# EasyEDA Pro project FanTempController.eprj

# Schematic Schematic1

## Sheets
1 Power: Board Name: Board1; Create Date: 2025-06-21; Page Name: Power; Project Name: FanTempController; Schematic Name: Schematic1; Update Date: 2025-07-06; Company: 嘉立创EDA; Page Size: A4; Version: V1.0
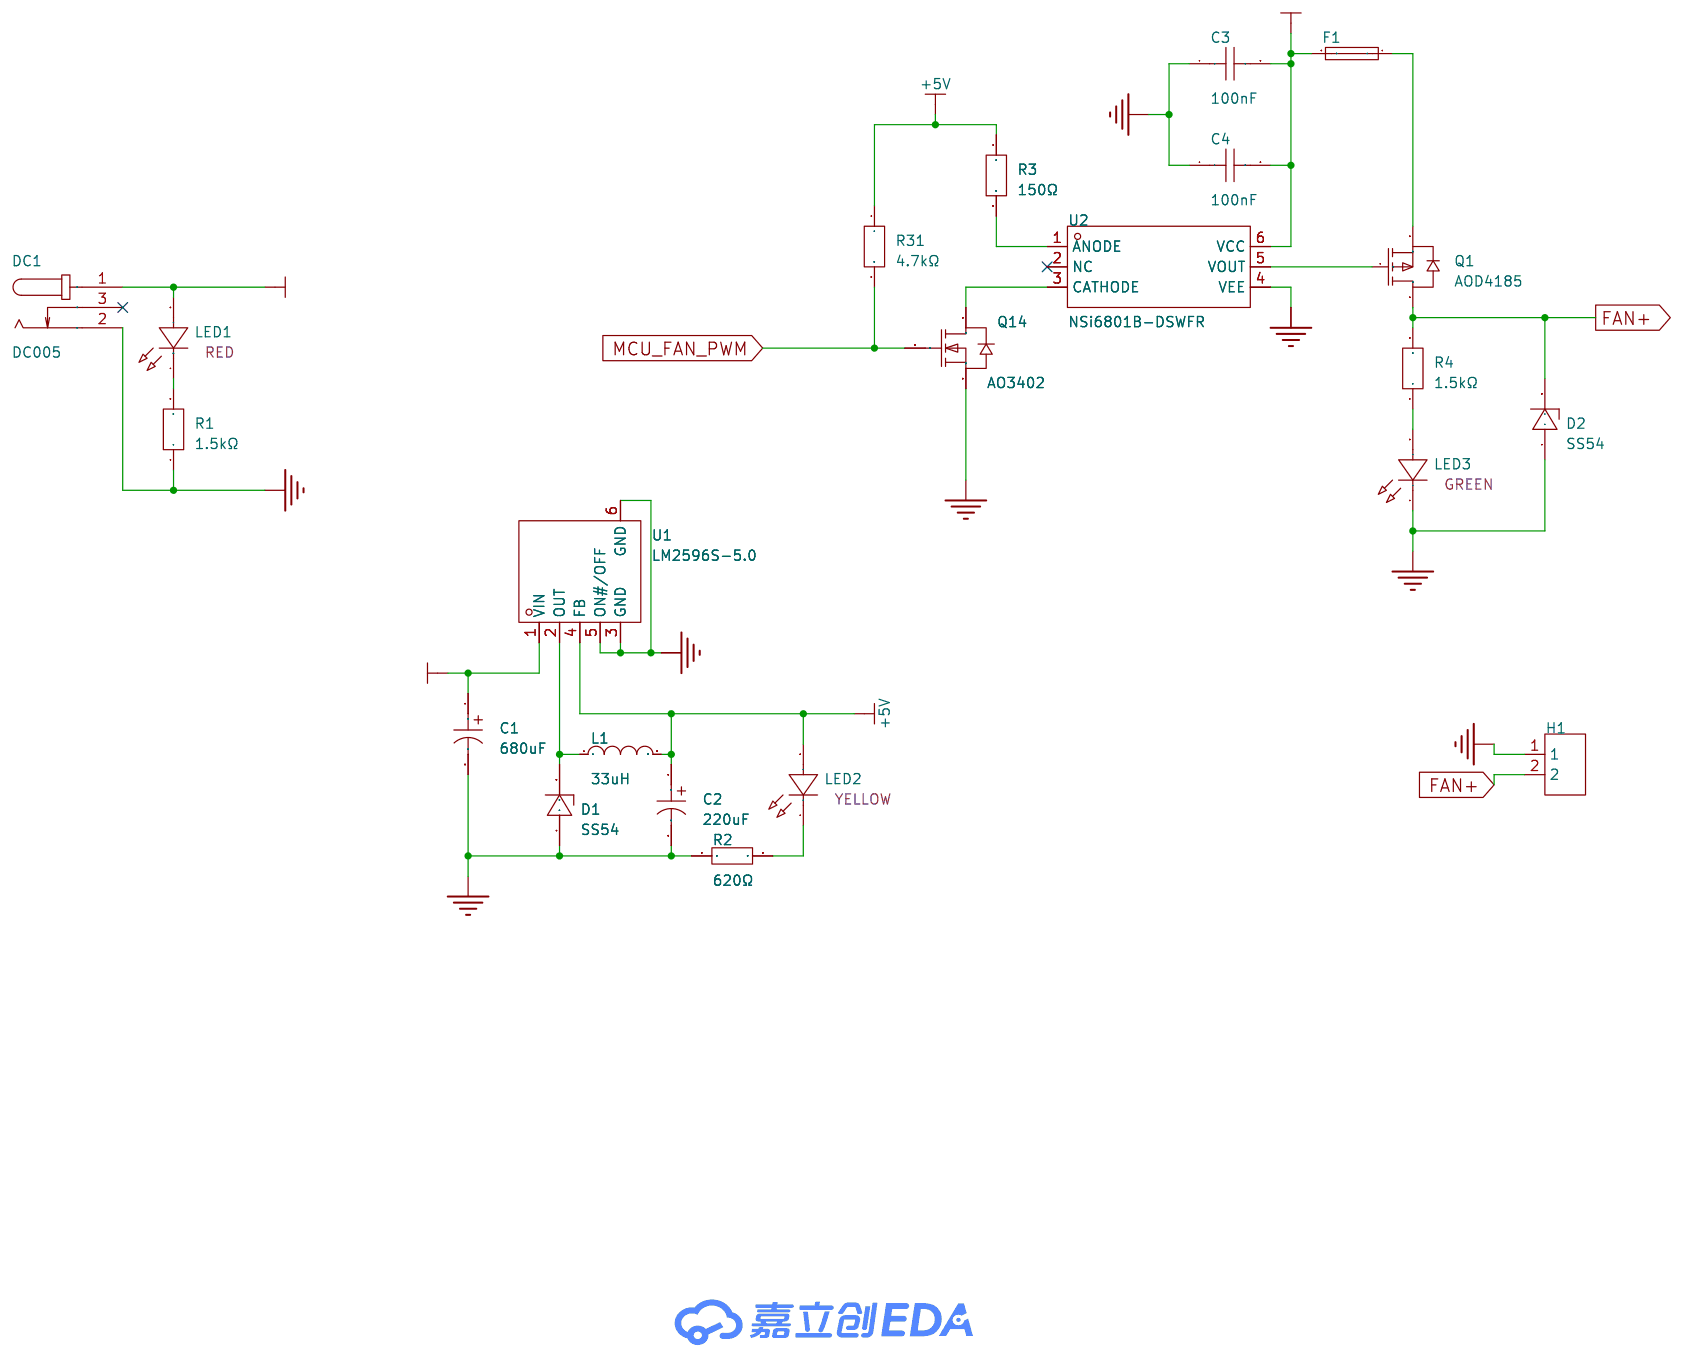
[diagram p0: Power]
2 MCU: Create Date: 2025-06-22; Page Name: MCU; Update Date: 2025-07-05
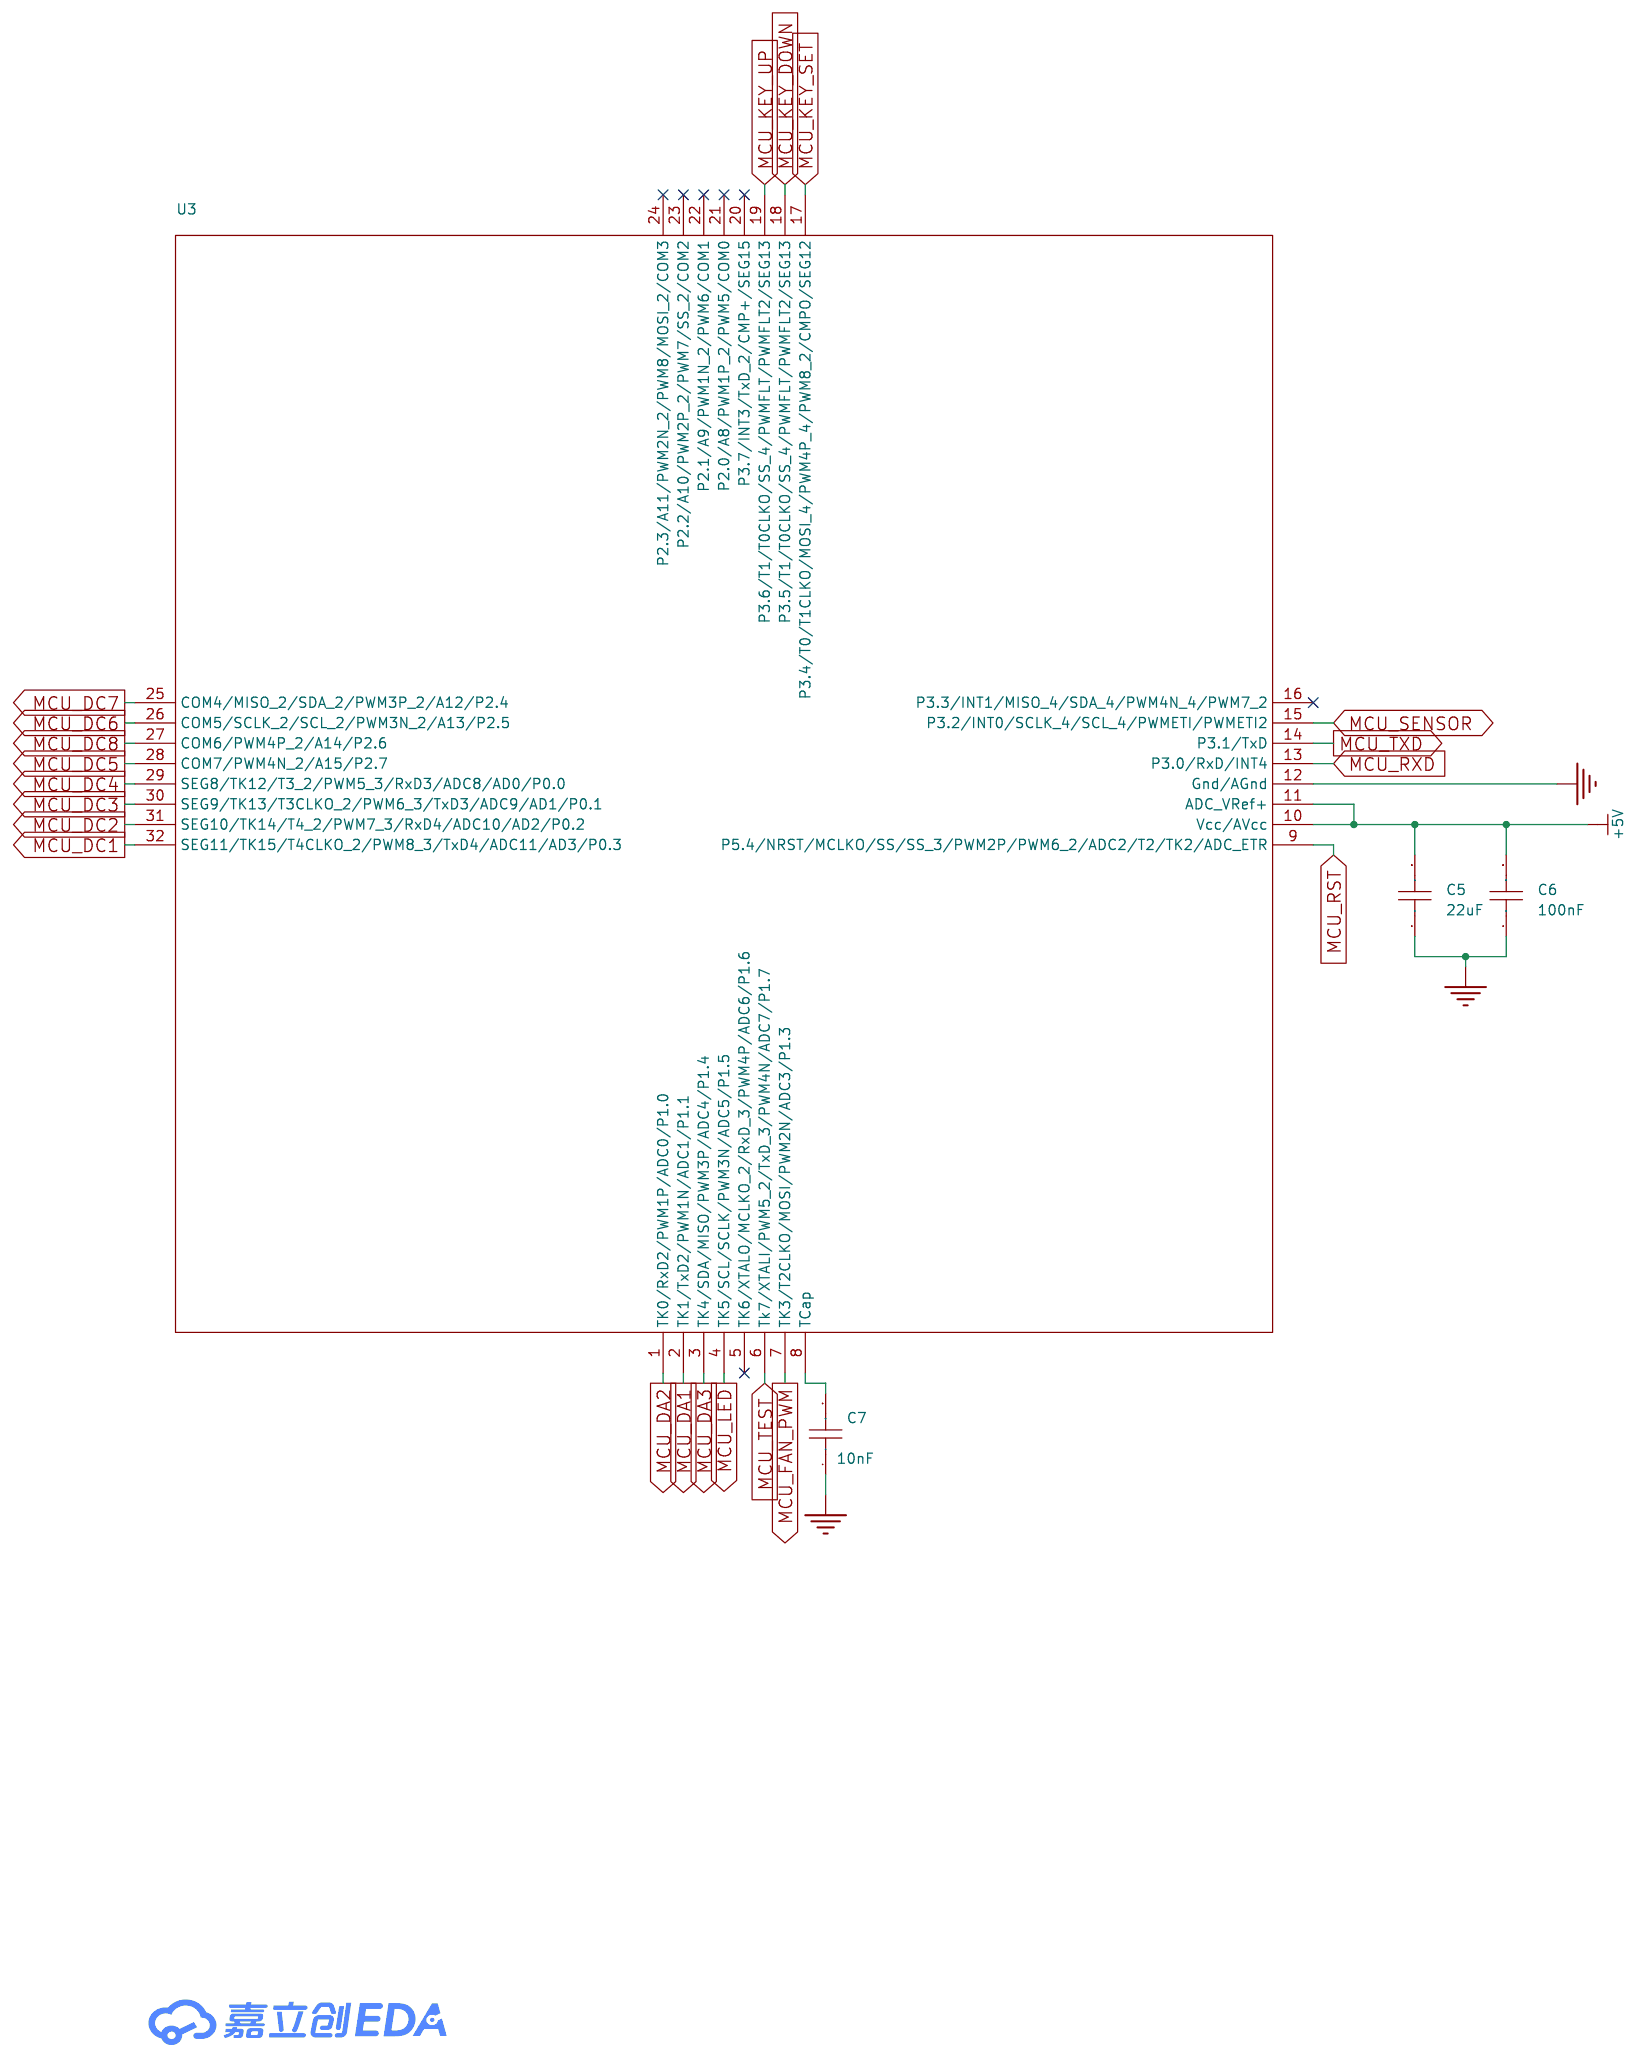
[diagram p1: MCU]
3 Others: Create Date: 2025-06-22; Page Name: Others; Update Date: 2025-06-26
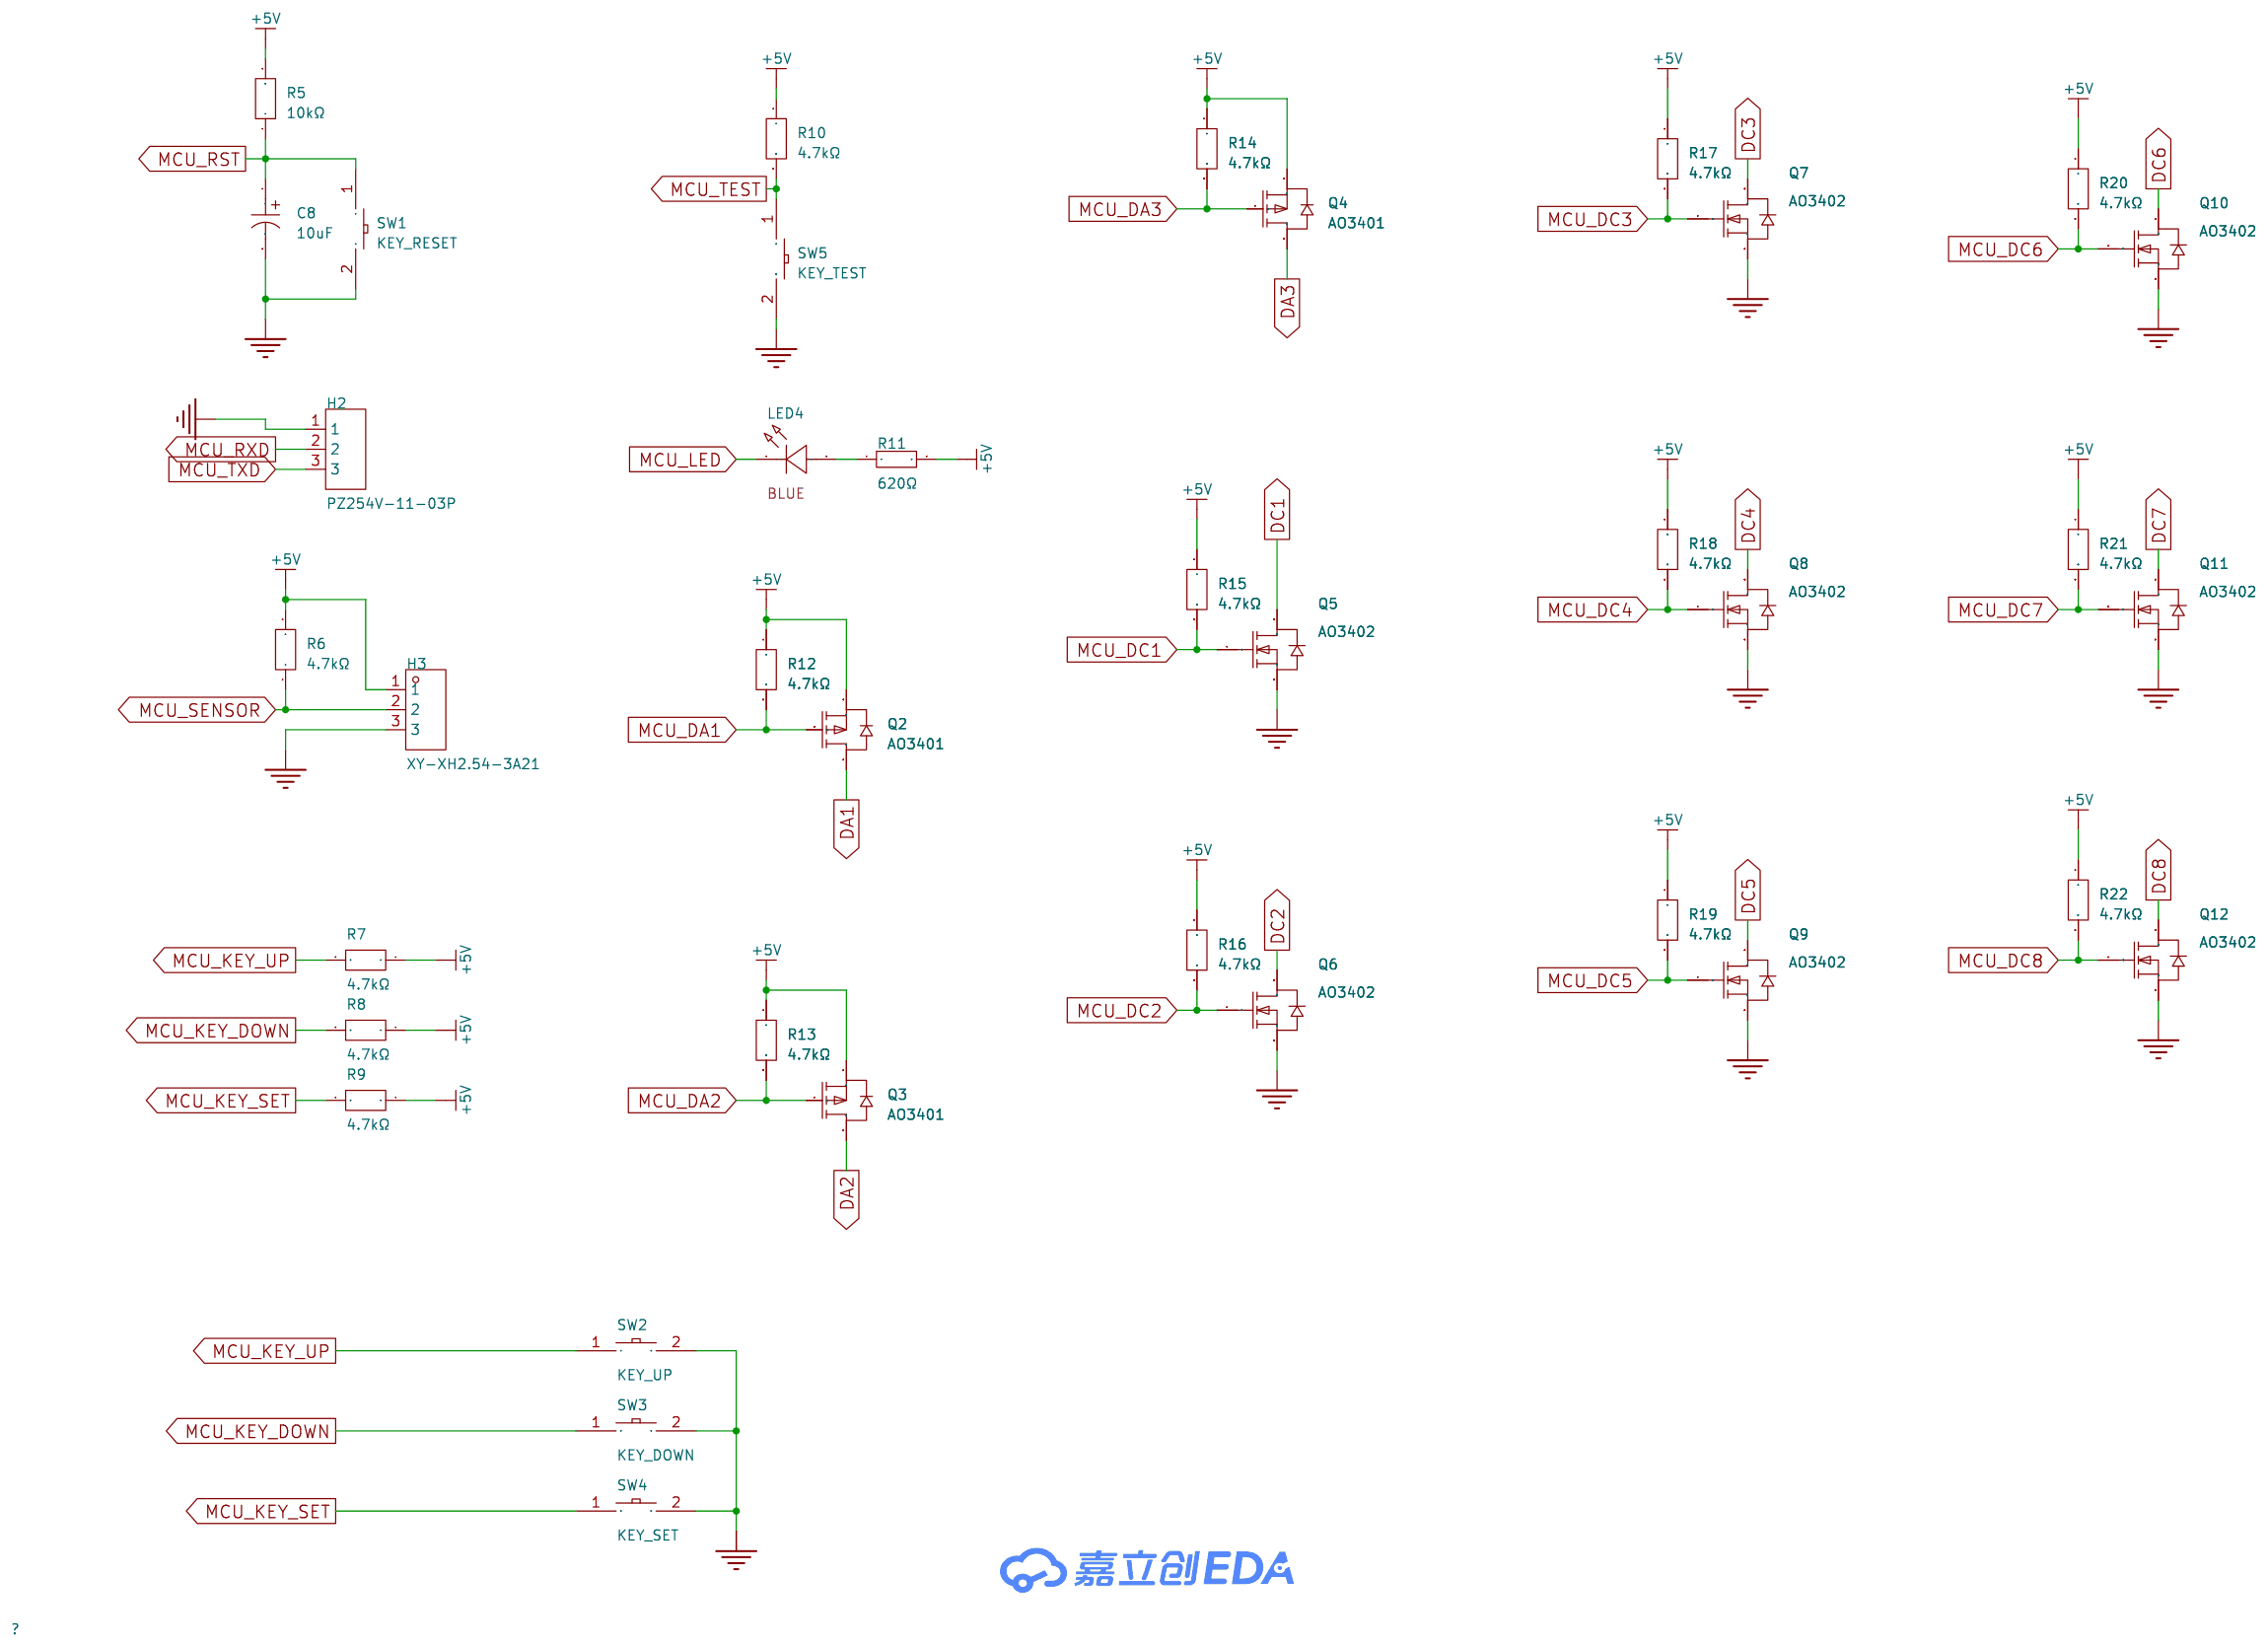
[diagram p2: Others]
4 Display: Create Date: 2025-06-22; Page Name: Display; Update Date: 2025-06-26
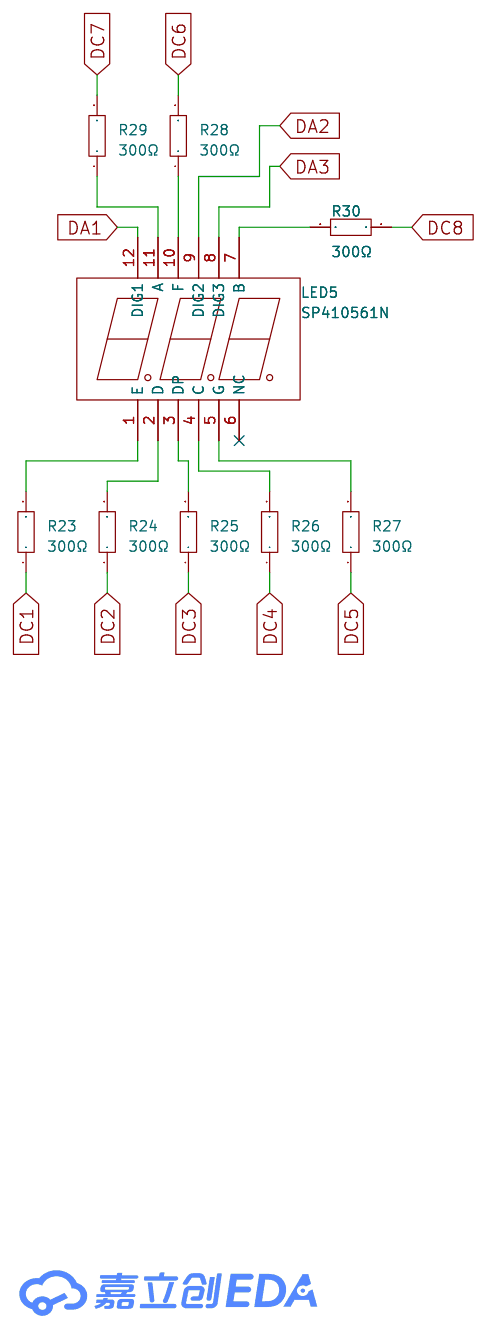
[diagram p3: Display]

## Parts
sheet Display
LED5  SP410561N  [LED-SEG-TH_12P-L37.6-W19.0-P2.54-S15.24-BL]
R23  300Ω  [R0805]
R24  300Ω  [R0805]
R25  300Ω  [R0805]
R26  300Ω  [R0805]
R27  300Ω  [R0805]
R28  300Ω  [R0805]
R29  300Ω  [R0805]
R30  300Ω  [R0805]
sheet MCU
C5  22uF  [C0805]
C6  100nF  [C0805]
C7  10nF  [C0805]
U3  -  [LQFP-32_L7.0-W7.0-P0.80-LS9.0-BL]
sheet Others
C8  10uF  [CAP-SMD_BD4.0-L4.3-W4.3-LS5.0-FD]
H2  PZ254V-11-03P  [HDR-TH_3P-P2.54-V-M]
H3  XY-XH2.54-3A21  [HDR-TH_3P-P2.50-H-F-W7.0-N]
LED4  LTL1KHKSD-071A  [LED-TH_BD3.8-P2.54-RD]
Q2  AO3401  [SOT-23-3_L2.9-W1.6-P1.90-LS2.8-BR]
Q3  AO3401  [SOT-23-3_L2.9-W1.6-P1.90-LS2.8-BR]
Q4  AO3401  [SOT-23-3_L2.9-W1.6-P1.90-LS2.8-BR]
Q5  AO3402  [SOT-23_L2.9-W1.3-P1.90-LS2.4-BR]
Q6  AO3402  [SOT-23_L2.9-W1.3-P1.90-LS2.4-BR]
Q7  AO3402  [SOT-23_L2.9-W1.3-P1.90-LS2.4-BR]
Q8  AO3402  [SOT-23_L2.9-W1.3-P1.90-LS2.4-BR]
Q9  AO3402  [SOT-23_L2.9-W1.3-P1.90-LS2.4-BR]
Q10  AO3402  [SOT-23_L2.9-W1.3-P1.90-LS2.4-BR]
Q11  AO3402  [SOT-23_L2.9-W1.3-P1.90-LS2.4-BR]
Q12  AO3402  [SOT-23_L2.9-W1.3-P1.90-LS2.4-BR]
R5  10kΩ  [R0805]
R6  4.7kΩ  [R0805]
R7  4.7kΩ  [R0805]
R8  4.7kΩ  [R0805]
R9  4.7kΩ  [R0805]
R10  4.7kΩ  [R0805]
R11  620Ω  [R0805]
R12  4.7kΩ  [R0805]
R13  4.7kΩ  [R0805]
R14  4.7kΩ  [R0805]
R15  4.7kΩ  [R0805]
R16  4.7kΩ  [R0805]
R17  4.7kΩ  [R0805]
R18  4.7kΩ  [R0805]
R19  4.7kΩ  [R0805]
R20  4.7kΩ  [R0805]
R21  4.7kΩ  [R0805]
R22  4.7kΩ  [R0805]
SW1  KEY_RESET  [SW-SMD_L6.0-W3.5-LS8.1_UK-B0306T-WB-250JZ]
SW2  KEY_UP  [SW-SMD_L6.0-W3.5-LS8.1_UK-B0306T-WB-250JZ]
SW3  KEY_DOWN  [SW-SMD_L6.0-W3.5-LS8.1_UK-B0306T-WB-250JZ]
SW4  KEY_SET  [SW-SMD_L6.0-W3.5-LS8.1_UK-B0306T-WB-250JZ]
SW5  KEY_TEST  [SW-SMD_L6.0-W3.5-LS8.1_UK-B0306T-WB-250JZ]
sheet Power
C1  680uF  [CAP-SMD_BD10.0-L10.3-W10.3-LS11.0-FD]
C2  220uF  [CAP-SMD_BD8.0-L8.3-W8.3-FD]
C3  100nF  [C0805]
C4  100nF  [C0805]
D1  SS54  [SMA_L4.3-W2.6-LS5.0-FD]
D2  SS54  [SMA_L4.3-W2.6-LS5.0-FD]
DC1  DC005  [DC-IN-TH_DC005]
F1  SMD1812-200-30  [F1812]
H1  B25410120-2PB0513-H25A60  [HDR-TH_2P-P2.54-V-M-3]
L1  33uH  [IND-SMD_L11.0-W10.2_CXP1050]
LED1  LTL17KRH5D-012A  [LED-TH_BD3.8-P2.54-RD-RED]
LED2  LTL1KHKSD-071A  [LED-TH_BD3.8-P2.54-RD]
LED3  LTL1KHKSD-071A  [LED-TH_BD3.8-P2.54-RD]
Q1  AOD4185  [TO-252-3_L6.6-W6.1-P4.57-LS9.9-BR-CW]
Q14  AO3402  [SOT-23_L2.9-W1.3-P1.90-LS2.4-BR]
R1  1.5kΩ  [R0805]
R2  620Ω  [R0805]
R3  150Ω  [R0805]
R4  1.5kΩ  [R0805]
R31  4.7kΩ  [R0805]
U1  LM2596S-5.0  [TO-263-5_L10.1-W8.7-P1.70-LS15.2-BR]
U2  NSi6801B-DSWFR  [SOIC-6_L7.5-W4.7-P1.27-LS11.50-TL]

## Library data of the parts
LED5 = SP410561N: LCSC Part Name: 3位0.56英寸红色数码管 共阳极; Supplier Part: C98924; Manufacturer: ARKLED(方舟); Supplier Footprint: 插件; JLCPCB Part Class: 扩展库; Datasheet: https://atta.szlcsc.com/upload/public/pdf/source/20180620/C98924_8B6F6D234E67B3F37673B777B8AFD976.pdf; Supplier: LCSC; Number of Characters: 3位; Luminous Color: 红色; LED Polarity: 共阳极; Digit/Alpha Size(inch): 0.56
R23-R30 = 0805W8F3000T5E: LCSC Part Name: 300Ω ±1% 125mW 厚膜电阻; Supplier Part: C17617; Manufacturer: UNI-ROYAL(厚声); Supplier Footprint: 0805; JLCPCB Part Class: 基础库; Datasheet: https://atta.szlcsc.com/upload/public/pdf/source/20200306/C422600_1E6D84923E4A46A82E41ADD87F860B5C.pdf; Supplier: LCSC; Type: 厚膜电阻; Tolerance: ±1%; Power(Watts): 125mW; Overload Voltage (Max): 150V; Temperature Coefficient: ±100ppm/℃; Operating Temperature Range: -55℃~+155℃
C5 = CL21Z226MQYVPNE: LCSC Part Name: 22uF ±20% 6.3V; Supplier Part: C6150103; Manufacturer: SAMSUNG(三星); Supplier Footprint: 0805; JLCPCB Part Class: 扩展库; Datasheet: https://atta.szlcsc.com/upload/public/pdf/source/20241202/1BDE01DAB2E9CA02F4EFA28F0C1F172B.pdf; Supplier: LCSC; Tolerance: ±20%; Voltage Rating: 6.3V; Temperature Coefficient: X7T
C3 C4 C6 = C0805X104K5RAC7210: LCSC Part Name: 100nF ±10% 50V; Supplier Part: C1864747; Manufacturer: KEMET(基美); Supplier Footprint: 0805; JLCPCB Part Class: Extended Part; Datasheet: https://atta.szlcsc.com/upload/public/pdf/source/20210401/3EFD8A2EC703B271DBCBA89912FC6ADE.pdf; Supplier: LCSC; Tolerance: ±10%; Voltage Rated: 50V; Temperature Coefficient: X7R
C7 = GCM21B5G1H103GA16L: LCSC Part Name: 10nF ±2% 50V; Supplier Part: C17592858; Manufacturer: muRata(村田); Supplier Footprint: 0805; JLCPCB Part Class: Extended Part; Datasheet: https://atta.szlcsc.com/upload/public/pdf/source/20240122/08E091E21912DE6536BB1E339F96B54B.pdf; Supplier: LCSC; Tolerance: ±2%; Voltage Rated: 50V; Temperature Coefficient: X8G
U3 = STC8H4K64TL-40I-LQFP32
C8 = RVT16V10M4X5: LCSC Part Name: 10uF ±20% 16V; Supplier Part: C47023101; Manufacturer: 捷而瑞; Supplier Footprint: SMD,D4xL5.4mm; JLCPCB Part Class: 扩展库; Datasheet: https://atta.szlcsc.com/upload/public/pdf/source/20250527/B74112AC258D4E2957E94942C36CEC95.pdf; Supplier: LCSC; Tolerance: ±20%; Voltage Rating: 16V; Ripple Current: 17mA@120Hz; Diameter: 4mm; Height - Seated (Max): 5.4mm; Operating Temperature: -55℃~+105℃
H2 = PZ254V-11-03P: LCSC Part Name: 1x3P 间距:2.54mm 方针 直插; Supplier Part: C2937625; Manufacturer: XFCN(兴飞); Supplier Footprint: 插件,P=2.54mm; JLCPCB Part Class: Extended Part; Datasheet: https://atta.szlcsc.com/upload/public/pdf/source/20200309/C492402_8335C3D49C4E4C618838D59BB1D024C1.pdf; Supplier: LCSC; Pin Structure: 1x3P; Pitch: 2.54mm; Circluar Pins/Square Pins: 方针; Mounting Type: 直插; Number of Rows: 单排; Number of Pins: 3P; Current Rating: 3A; Voltage Rating (Max): 250V; Length of Mating Pin: 6mm; Insulation Height: 2.5mm; Length of End Connection Pin: 3mm; Operating Temperature: -40℃~+105℃; Color: 黑色
H3 = XY-XH2.54-3A21: LCSC Part Name: 1x3P 间距:2.54mm 弯插; Supplier Part: C19271378; Manufacturer: XYECONN(辛译); Supplier Footprint: 弯插,P=2.54mm; JLCPCB Part Class: Extended Part; Datasheet: https://atta.szlcsc.com/upload/public/pdf/source/20231124/D66390E8C06C0EE50596E66A88591188.pdf; Supplier: LCSC; Pins Structure: 1x3P; Pitch: 2.54mm; Mounting Style: 弯插; Number of Pins: 3P; Number of Rows: 1; Number of PINs Per Row: 3; Row Spacing: 2.54mm; Current Rating (Max): 3A; Operating Temperature Range: -25℃~+85℃
LED4 = LTL1KHKSD-071A: LCSC Part Name: 插件LED; Supplier Part: C7435546; Manufacturer: LITEON(光宝); Supplier Footprint: D=3mm; JLCPCB Part Class: 扩展库; Supplier: LCSC; Emitted Color: BLUE
Q2-Q4 = AO3401_1: LCSC Part Name: AO3401 4.4A  P MOS大体积; Supplier Part: C20634975; Manufacturer: FOSAN(富捷/富信); Supplier Footprint: SOT-23-3L; JLCPCB Part Class: 扩展库; Datasheet: https://atta.szlcsc.com/upload/public/pdf/source/20240301/5324A8BF38A926A20CB45E863EAB25A7.pdf; Supplier: LCSC
Q5-Q12 Q14 = AO3402: LCSC Part Name: 1个N沟道 耐压:30V 电流:4A; Supplier Part: C14385; Manufacturer: AOS; Supplier Footprint: SOT-23; JLCPCB Part Class: 扩展库; Datasheet: https://atta.szlcsc.com/upload/public/pdf/source/20171023/C14385_15087455190191052858.pdf; Supplier: LCSC; Type: 1个N沟道; Drain Source Voltage (Vdss): 30V; Continuous Drain Current (Id): 4A; Drain Source On Resistance (RDS(on)@Vgs,Id): 43mΩ@10V,4A; Power Dissipation (Pd): 1.4W; Gate Threshold Voltage (Vgs(th)@Id): 1.5V@250uA; Total Gate Charge (Qg@Vgs): 12nC@10V; Input Capacitance (Ciss@Vds): 285pF; Reverse Transfer Capacitance (Crss@Vds): 25pF@15V; Operating Temperature: -55℃~+150℃
R5 = RCA0510KFLF: LCSC Part Name: 10kΩ ±1% 125mW; Supplier Part: C22356686; Manufacturer: HKR(香港电阻); Supplier Footprint: 0805; JLCPCB Part Class: 扩展库; Datasheet: https://atta.szlcsc.com/upload/public/pdf/source/20240312/EB29F8B3E9AD4CE07E65E9956C47F4F5.pdf; Supplier: LCSC; Tolerance: ±1%; Power(Watts): 125mW
R6-R10 R12-R22 R31 = SG73P2ATTD4701F: LCSC Part Name: 厚膜电阻 4.7kΩ ±1% 250mW; Supplier Part: C2577441; Manufacturer: KOA; Supplier Footprint: 0805; JLCPCB Part Class: 扩展库; Datasheet: https://atta.szlcsc.com/upload/public/pdf/source/20211128/256F1F916928CF6BBF01C1783BDAC507.pdf; Supplier: LCSC; Type: 厚膜电阻; Tolerance: ±1%; Power(Watts): 250mW; Temperature Coefficient: ±100ppm/℃; Operating Temperature: -55℃~+155℃
R2 R11 = 0805W8F6200T5E: LCSC Part Name: 620Ω ±1% 125mW 厚膜电阻; Supplier Part: C17782; Manufacturer: UNI-ROYAL(厚声); Supplier Footprint: 0805; JLCPCB Part Class: 扩展库; Datasheet: https://atta.szlcsc.com/upload/public/pdf/source/20200306/C422600_1E6D84923E4A46A82E41ADD87F860B5C.pdf; Supplier: LCSC; Type: 厚膜电阻; Tolerance: ±1%; Power(Watts): 125mW; Overload Voltage (Max): 150V; Temperature Coefficient: ±100ppm/℃; Operating Temperature Range: -55℃~+155℃
SW1-SW5 = UK-B0306T-WB-250JZ: LCSC Part Name: 轻触开关3.5*6*2.5贴片黑座白钮250GF 编带; Supplier Part: C7428411; Manufacturer: USAKRO(美韩); Supplier Footprint: SMD,3.5x6x2.5mm; JLCPCB Part Class: Extended Part; Datasheet: https://atta.szlcsc.com/upload/public/pdf/source/20230630/5D05E5B1B5E89E0622C76057B9B8311C.pdf; Supplier: LCSC; Operating Force: 2.5N; Switch Length: 6mm; Switch Width: 3.5mm; Switch Height: 2.5mm
C1 = GVE1E687M1010CN: LCSC Part Name: 680uF ±20% 25V; Supplier Part: C22383566; Manufacturer: ACMECON(鼎容); Supplier Footprint: SMD,D10xL10.5mm; JLCPCB Part Class: 扩展库; Datasheet: https://atta.szlcsc.com/upload/public/pdf/source/20240711/A40BBE00FFBCD7222582D0C7E53901B6.pdf; Supplier: LCSC; Tolerance: ±20%; Voltage Rating: 25V; Ripple Current: 670mA@100kHz
C2 = GVT1V227M0810CNVC: LCSC Part Name: 220uF ±20% 35V; Supplier Part: C2983323; Manufacturer: HRK(鸿瑞凯电子); Supplier Footprint: SMD,D8xL10.5mm; JLCPCB Part Class: 扩展库; Datasheet: https://atta.szlcsc.com/upload/public/pdf/source/20220321/BA17E910A44EA2B508CDD6AB8BA576BA.pdf; Supplier: LCSC; Tolerance: ±20%; Rated Voltage: 35V; Ripple Current: 175mA@120Hz; φD: 8mm; L: 10.5mm; Lifetime @ Temp: 2000hrs@105℃; Operating Temperature: -55℃~+105℃
D1 D2 = SS54_C7420369: LCSC Part Name: 电压:40V 电流:5A; Supplier Part: C7420369; Manufacturer: 宏迦橙; Supplier Footprint: SMA(DO-214AC); JLCPCB Part Class: 扩展库; Datasheet: https://atta.szlcsc.com/upload/public/pdf/source/20230828/254C3882F8647358AD9F60DD73611B5E.pdf; Supplier: LCSC; Diode Configuration: 独立式; Forward Voltage (Vf@If): 550mV@5.0A; Reverse Voltage (Vr): 40V; Rectified Current: 5A; Reverse Leakage Current (Ir): 50uA@40V
DC1 = DC005: LCSC Part Name: DC电源插座 内径:2mm 外径:6.3mm; Supplier Part: C431533; Manufacturer: SHOU HAN(首韩); Supplier Footprint: 插件; JLCPCB Part Class: 扩展库; Datasheet: https://atta.szlcsc.com/upload/public/pdf/source/20190925/C431533_4751811035784AC1D38EBC85F7905E99.pdf; Supplier: LCSC; Connector Type: DC电源插座; Mounting Style: 弯插; Inside Contact Diameter: 2mm; Outside Contact Diameter: 6.3mm; Current Rating (Max): 500mA; Voltage Rating (Max): 30V; Operating Temperature Range: -25℃~+70℃
F1 = SMD1812-200-30: Supplier Part: C46641168; Manufacturer: 宏嘉诚; Supplier Footprint: 1812; JLCPCB Part Class: 扩展库; Datasheet: https://atta.szlcsc.com/upload/public/pdf/source/20250414/001E61D6A0C78432CBCACDD44FA2AE48.pdf; Supplier: LCSC; Voltage - Max: 30V; Current - Max: 40A; Hold Current: 2A; Trip Current: 4A; Power Dissipation: 1W; Resistance - Initial (Ri) (Min): 20mΩ; Resistance - Post Trip (R1) (Max): 100mΩ; Time to Trip(Max): 2s
H1 = B25410120-2PB0513-H25A60: LCSC Part Name: 间距:2.54mm 1X2P 直插 方针; Supplier Part: C42385478; Manufacturer: HMTCONN(华明通); Supplier Footprint: 插件,P=2.54mm; Datasheet: https://atta.szlcsc.com/upload/public/pdf/source/20241114/BA9A59CA6DEC78ECD42560940D1296C3.pdf; Supplier: LCSC
L1 = CXP1050-6R8M-AG(6.8uh): LCSC Part Name: 6.8uH ±20% 13A; Supplier Part: C7461390; Manufacturer: DMBJ(振宝佳); Supplier Footprint: 1050; JLCPCB Part Class: 扩展库; Datasheet: https://atta.szlcsc.com/upload/public/pdf/source/20230706/7F3A5B39C5AD80A91C9FA782B54A296B.pdf; Supplier: LCSC; Tolerance: ±20%; Rated Current: 8.5A; Saturation Current (Isat): 13A; DC Resistance (DCR): 18.5mΩ; Type: 一体成型电感
LED1 = LTL17KRH5D-012A: LCSC Part Name: 插件LED; Supplier Part: C7435538; Manufacturer: LITEON(光宝); Supplier Footprint: D=3mm; JLCPCB Part Class: 扩展库; Supplier: LCSC; Emitted Color: RED
LED2 = LTL1KHKSD-071A: LCSC Part Name: 插件LED; Supplier Part: C7435546; Manufacturer: LITEON(光宝); Supplier Footprint: D=3mm; JLCPCB Part Class: 扩展库; Supplier: LCSC; Emitted Color: YELLOW
LED3 = LTL1KHKSD-071A: LCSC Part Name: 插件LED; Supplier Part: C7435546; Manufacturer: LITEON(光宝); Supplier Footprint: D=3mm; JLCPCB Part Class: 扩展库; Supplier: LCSC; Emitted Color: GREEN
Q1 = AOD4185_C400894: LCSC Part Name: 1个P沟道 耐压:40V 电流:40A; Supplier Part: C400894; Manufacturer: AOS; Supplier Footprint: TO-252(DPAK); JLCPCB Part Class: 扩展库; Datasheet: https://atta.szlcsc.com/upload/public/pdf/source/20190627/C400894_921958B6CB7B7C674397E60AAED89785.pdf; Supplier: LCSC; Type: 1个P沟道; Drain Source Voltage (Vdss): 40V; Continuous Drain Current (Id): 40A; Drain Source On Resistance (RDS(on)@Vgs,Id): 20mΩ@4.5V,15A; Power Dissipation (Pd): 62.5W; Gate Threshold Voltage (Vgs(th)@Id): 1.7V@250uA; Total Gate Charge (Qg@Vgs): 42nC@10V; Input Capacitance (Ciss@Vds): 2.55nF@20V; Reverse Transfer Capacitance (Crss@Vds): 190pF@20V; Operating Temperature: -55℃~+175℃
R1 R4 = FRC0805F1501TS: LCSC Part Name: 1.5kΩ ±1% 125mW 厚膜电阻; Supplier Part: C2907216; Manufacturer: FOJAN(富捷); Supplier Footprint: 0805; JLCPCB Part Class: 扩展库; Datasheet: https://atta.szlcsc.com/upload/public/pdf/source/20211221/925EC7D7225764EE0046F22065062C87.pdf; Supplier: LCSC; Type: 厚膜电阻; Tolerance: ±1%; Power(Watts): 125mW; Voltage-Supply(Max): 150V; Temperature Coefficient: ±100ppm/℃; Operating Temperature: -55℃~+155℃
R3 = FRC0805J151 TS: LCSC Part Name: 150Ω ±5% 125mW 厚膜电阻; Supplier Part: C2907300; Manufacturer: FOJAN(富捷); Supplier Footprint: 0805; JLCPCB Part Class: 扩展库; Datasheet: https://atta.szlcsc.com/upload/public/pdf/source/20211221/925EC7D7225764EE0046F22065062C87.pdf; Supplier: LCSC; Type: 厚膜电阻; Tolerance: ±5%; Power(Watts): 125mW; Overload Voltage (Max): 150V; Temperature Coefficient: ±100ppm/℃; Operating Temperature Range: -55℃~+155℃
U1 = LM2596S-5.0_C5276750: LCSC Part Name: 3A降压电压调节器; Supplier Part: C5276750; Manufacturer: TWGMC(台湾迪嘉); Supplier Footprint: TO-263-5; JLCPCB Part Class: 扩展库; Datasheet: https://atta.szlcsc.com/upload/public/pdf/source/20221121/BE66229392871E6008E3503EDFD620B9.pdf; Supplier: LCSC; Function: 降压型; Output Type: 固定; Output Voltage: 5V; Switching Frequency: 150kHz; Operating Temperature: -40℃~+125℃; Number of Outputs: 1; Topology: 降压式
U2 = NSi6801B-DSWFR_C3029750: Supplier Part: C3029750; Manufacturer: NOVOSENSE(纳芯微); Supplier Footprint: SOW-6; JLCPCB Part Class: 扩展库; Datasheet: https://atta.szlcsc.com/upload/public/pdf/source/20220531/230F2E7CF69C24FBD35BDDC065427607.pdf; Supplier: LCSC

## Nets
+5V: C2.1 C5.2 C6.2 H3.1 L1.2 LED2.2(A) Q2.2(S) Q3.2(S) Q4.2(S) R3.1 R5.2 R6.2 R7.1 R8.1 R9.1 R10.1 R11.2 R12.1 R13.1 R14.1 R15.1 R16.1 R17.1 R18.1 R19.1 R20.1 R21.1 R22.1 R31.1 U1.4(FB) U3.10(Vcc/AVcc) U3.11(ADC_VRef+)
GND: C1.2 C2.2 C3.1 C4.1 C5.1 C6.1 C7.1 C8.2 D1.1(A) D2.1(A) DC1.2 H1.1 H2.1 H3.3 LED3.1(K) Q5.2(S) Q6.2(S) Q7.2(S) Q8.2(S) Q9.2(S) Q10.2(S) Q11.2(S) Q12.2(S) Q14.2(S) R1.1 R2.1 SW1.2 SW2.2 SW3.2 SW4.2 SW5.2 U1.3(GND) U1.5(ON#/OFF) U1.6(GND) U2.4(VEE) U3.12(Gnd/AGnd)
DA1: LED5.12(DIG1) Q2.3(D)
DA2: LED5.9(DIG2) Q3.3(D)
DA3: LED5.8(DIG3) Q4.3(D)
DC1: Q5.3(D) R23.1
DC2: Q6.3(D) R24.1
DC3: Q7.3(D) R25.1
DC4: Q8.3(D) R26.1
DC5: Q9.3(D) R27.1
DC6: Q10.3(D) R28.2
DC7: Q11.3(D) R29.2
DC8: Q12.3(D) R30.1
FAN+: D2.2(K) H1.2 Q1.2(D) R4.2
MCU_DA1: Q2.1(G) R12.2 U3.2(TK1/TxD2/PWM1N/ADC1/P1.1)
MCU_DA2: Q3.1(G) R13.2 U3.1(TK0/RxD2/PWM1P/ADC0/P1.0)
MCU_DA3: Q4.1(G) R14.2 U3.3(TK4/SDA/MISO/PWM3P/ADC4/P1.4)
MCU_DC1: Q5.1(G) R15.2 U3.32(SEG11/TK15/T4CLKO_2/PWM8_3/TxD4/ADC11/AD3/P0.3)
MCU_DC2: Q6.1(G) R16.2 U3.31(SEG10/TK14/T4_2/PWM7_3/RxD4/ADC10/AD2/P0.2)
MCU_DC3: Q7.1(G) R17.2 U3.30(SEG9/TK13/T3CLKO_2/PWM6_3/TxD3/ADC9/AD1/P0.1)
MCU_DC4: Q8.1(G) R18.2 U3.29(SEG8/TK12/T3_2/PWM5_3/RxD3/ADC8/AD0/P0.0)
MCU_DC5: Q9.1(G) R19.2 U3.28(COM7/PWM4N_2/A15/P2.7)
MCU_DC6: Q10.1(G) R20.2 U3.26(COM5/SCLK_2/SCL_2/PWM3N_2/A13/P2.5)
MCU_DC7: Q11.1(G) R21.2 U3.25(COM4/MISO_2/SDA_2/PWM3P_2/A12/P2.4)
MCU_DC8: Q12.1(G) R22.2 U3.27(COM6/PWM4P_2/A14/P2.6)
MCU_FAN_PWM: Q14.1(G) R31.2 U3.7(TK3/T2CLKO/MOSI/PWM2N/ADC3/P1.3)
MCU_KEY_DOWN: R8.2 SW3.1 U3.18(P3.5/T1/T0CLKO/SS_4/PWMFLT/PWMFLT2/SEG13)
MCU_KEY_SET: R9.2 SW4.1 U3.17(P3.4/T0/T1CLKO/MOSI_4/PWM4P_4/PWM8_2/CMPO/SEG12)
MCU_KEY_UP: R7.2 SW2.1 U3.19(P3.6/T1/T0CLKO/SS_4/PWMFLT/PWMFLT2/SEG13)
MCU_LED: LED4.1(K) U3.4(TK5/SCL/SCLK/PWM3N/ADC5/P1.5)
MCU_RST: C8.1 R5.1 SW1.1 U3.9(P5.4/NRST/MCLKO/SS/SS_3/PWM2P/PWM6_2/ADC2/T2/TK2/ADC_ETR)
MCU_RXD: H2.2 U3.13(P3.0/RxD/INT4)
MCU_SENSOR: H3.2 R6.1 U3.15(P3.2/INT0/SCLK_4/SCL_4/PWMETI/PWMETI2)
MCU_TEST: R10.2 SW5.1 U3.6(Tk7/XTALI/PWM5_2/TxD_3/PWM4N/ADC7/P1.7)
MCU_TXD: H2.3 U3.14(P3.1/TxD)
VSUPPLY: C1.1 C3.2 C4.2 DC1.1 F1.2 LED1.2(A) U1.1(VIN) U2.6(VCC)
$1N933: D1.2(K) L1.1 U1.2(OUT)
$1N1155: LED1.1(C) R1.2
$1N1974: Q1.1(G) U2.5(VOUT)
$1N1988: F1.1 Q1.3(S)
$1N2065: LED2.1(K) R2.2
$1N2770: LED3.2(A) R4.1
$1N5073: Q14.3(D) U2.3(CATHODE)
$1N5078: R3.2 U2.1(ANODE)
$2N627: C7.2 U3.8(TCap)
$3N2148: LED4.2(A) R11.1
$4N526: LED5.1(E) R23.2
$4N532: LED5.2(D) R24.2
$4N539: LED5.3(DP) R25.2
$4N546: LED5.4(C) R26.2
$4N553: LED5.5(G) R27.2
$4N573: LED5.7(B) R30.2
$4N1142: LED5.10(F) R28.1
$4N1146: LED5.11(A) R29.1

Not connected (* = marked no-connect by the designer): DC1 3*; LED5 6(NC)*; U2 2(NC)*; U3 5(TK6/XTALO/MCLKO_2/RxD_3/PWM4P/ADC6/P1.6)* 16(P3.3/INT1/MISO_4/SDA_4/PWM4N_4/PWM7_2)* 20(P3.7/INT3/TxD_2/CMP+/SEG15)* 21(P2.0/A8/PWM1P_2/PWM5/COM0)* 22(P2.1/A9/PWM1N_2/PWM6/COM1)* 23(P2.2/A10/PWM2P_2/PWM7/SS_2/COM2)* 24(P2.3/A11/PWM2N_2/PWM8/MOSI_2/COM3)*

# Board PCB1
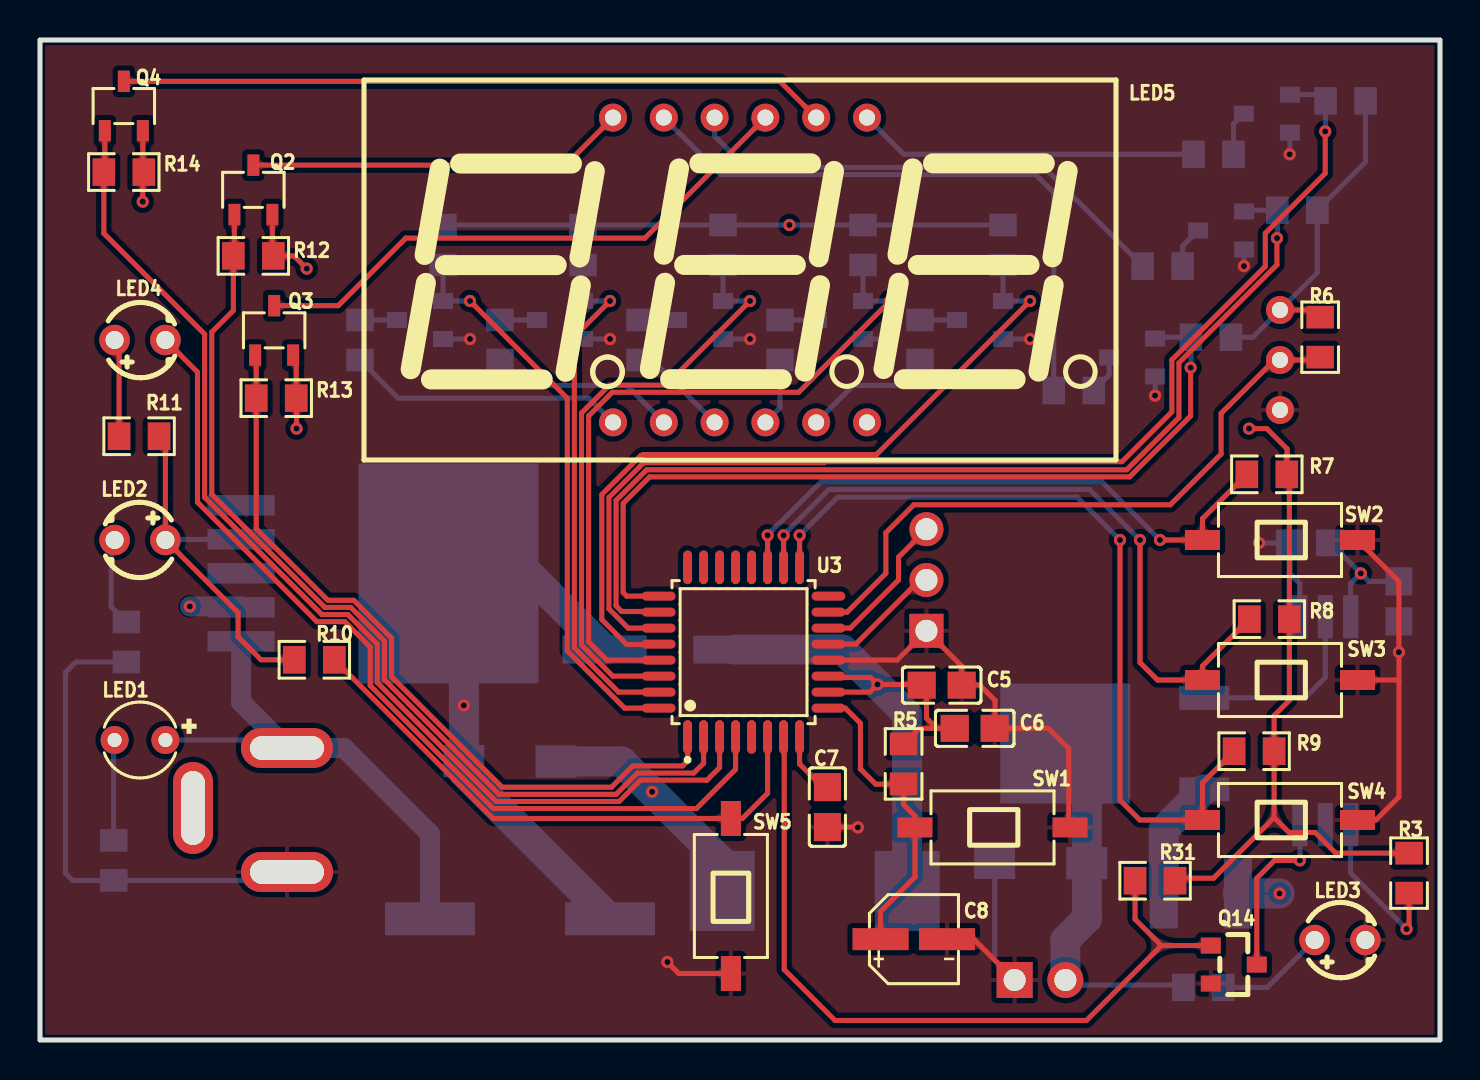
[diagram p4: board, top side]
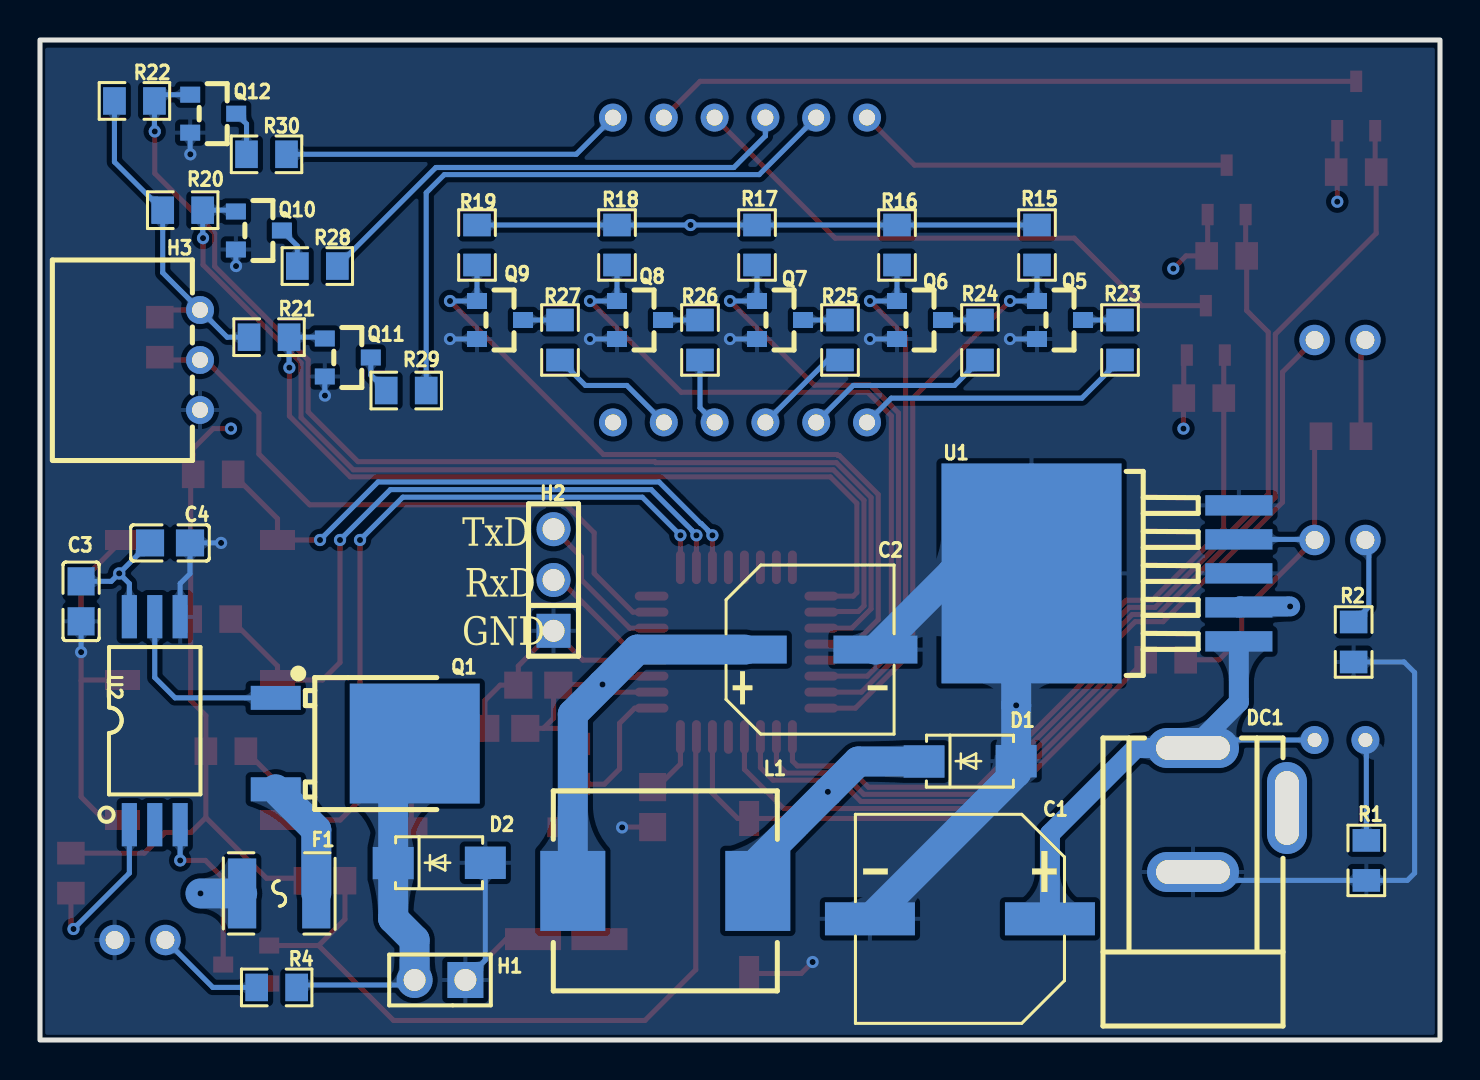
[diagram p5: board, bottom side, seen from below]

Outline 70 x 50 mm; copper layers: Top Layer, 地层, 供电层, Bottom Layer. Coordinates in mm from the lower left corner of the outline.
Outline path: rectangle 0,50 70,0
Stack: Top Layer 0.035mm 外层铜厚1oz / Dielectric1 0.2104mm 7628 RC49% 8.6mil / 地层 0.0152mm 内层铜厚 / Dielectric2 1.065mm 1.1mm H/HOZ Copper / 供电层 0.0152mm 内层铜厚 / Dielectric3 0.2104mm 7628 RC49% 8.6mil / Bottom Layer 0.035mm 外层铜厚1oz

## Design rules (mm)
template: JLCPCB Capability(Two Layers Board)
spacing copperThickness1oz (default): track to track 0.102, other pairs 0.152 to 0.3
spacing copperThickness2oz: track to track 0.203, other pairs 0.152 to 0.3
track width copperThickness1oz (default): min 0.127, default 0.254, max 2.54
track width copperThickness2oz: min 0.203, default 0.254, max 2.54
differential pair differentialPair (default): width min 0.127, default 0.254, max 2.54; gap min 0.152, default 0.152
via viaSize (default): diameter min 0.5, default 0.61, max 10; hole min 0.3, default 0.305, max 6.3

## Placement (name value [footprint] x y rotation side)
C1  680uF  [CAP-SMD_BD10.0-L10.3-W10.3-LS11.0-FD]  24 6.06 0 bottom
C2  220uF  [CAP-SMD_BD8.0-L8.3-W8.3-FD]  31.5 19.52 180 bottom
C3  100nF  [C0805]  67.94 21.93 90 bottom
C4  100nF  [C0805]  63.5 24.85 0 bottom
C5  22uF  [C0805]  45.09 17.74 180 top
C6  100nF  [C0805]  46.74 15.58 180 top
C7  10nF  [C0805]  39.37 11.65 90 top
C8  10uF  [CAP-SMD_BD4.0-L4.3-W4.3-LS5.0-FD]  43.69 5.04 0 top
D1  SS54  [SMA_L4.3-W2.6-LS5.0-FD]  23.5 13.93 0 bottom
D2  SS54  [SMA_L4.3-W2.6-LS5.0-FD]  50.04 8.85 0 bottom
DC1  DC005  [DC-IN-TH_DC005]  10 11.5 90 bottom
F1  SMD1812-200-30  [F1812]  58.04 7.33 0 bottom
H1  B25410120-2PB0513-H25A60  [HDR-TH_2P-P2.54-V-M-3]  50 3 0 bottom
H2  PZ254V-11-03P  [HDR-TH_3P-P2.54-V-M]  44.32 23 90 bottom
H3  XY-XH2.54-3A21  [HDR-TH_3P-P2.50-H-F-W7.0-N]  62 34 270 bottom
L1  33uH  [IND-SMD_L11.0-W10.2_CXP1050]  38.74 7.45 0 bottom
LED1  LTL17KRH5D-012A  [LED-TH_BD3.8-P2.54-RD-RED]  5 15 0 top
LED2  LTL1KHKSD-071A  [LED-TH_BD3.8-P2.54-RD]  5 25 0 top
LED3  LTL1KHKSD-071A  [LED-TH_BD3.8-P2.54-RD]  65 5 180 top
LED4  LTL1KHKSD-071A  [LED-TH_BD3.8-P2.54-RD]  5 35 180 top
LED5  SP410561N  [LED-SEG-TH_12P-L37.6-W19.0-P2.54-S15.24-BL]  35 38.5 0 top
Q1  AOD4185  [TO-252-3_L6.6-W6.1-P4.57-LS9.9-BR-CW]  54.74 14.82 0 bottom
Q2  AO3401  [SOT-23-3_L2.9-W1.6-P1.90-LS2.8-BR]  10.67 42.51 270 top
Q3  AO3401  [SOT-23-3_L2.9-W1.6-P1.90-LS2.8-BR]  11.71 35.48 270 top
Q4  AO3401  [SOT-23-3_L2.9-W1.6-P1.90-LS2.8-BR]  4.19 46.7 270 top
Q5  AO3402  [SOT-23_L2.9-W1.3-P1.90-LS2.4-BR]  19 36 0 bottom
Q6  AO3402  [SOT-23_L2.9-W1.3-P1.90-LS2.4-BR]  26 36 0 bottom
Q7  AO3402  [SOT-23_L2.9-W1.3-P1.90-LS2.4-BR]  33 36 0 bottom
Q8  AO3402  [SOT-23_L2.9-W1.3-P1.90-LS2.4-BR]  40 36 0 bottom
Q9  AO3402  [SOT-23_L2.9-W1.3-P1.90-LS2.4-BR]  47 36 0 bottom
Q10  AO3402  [SOT-23_L2.9-W1.3-P1.90-LS2.4-BR]  59.06 40.47 0 bottom
Q11  AO3402  [SOT-23_L2.9-W1.3-P1.90-LS2.4-BR]  54.61 34.12 0 bottom
Q12  AO3402  [SOT-23_L2.9-W1.3-P1.90-LS2.4-BR]  61.34 46.32 0 bottom
Q14  AO3402  [SOT-23_L2.9-W1.3-P1.90-LS2.4-BR]  59.69 3.77 180 top
R1  1.5kΩ  [R0805]  3.68 8.98 90 bottom
R2  620Ω  [R0805]  4.32 19.9 90 bottom
R3  150Ω  [R0805]  68.45 8.34 270 top
R4  1.5kΩ  [R0805]  58.17 2.63 180 bottom
R5  10kΩ  [R0805]  43.18 13.81 90 top
R6  4.7kΩ  [R0805]  64.01 35.14 90 top
R7  4.7kΩ  [R0805]  61.34 28.28 180 top
R8  4.7kΩ  [R0805]  61.47 21.04 180 top
R9  4.7kΩ  [R0805]  60.71 14.44 180 top
R10  4.7kΩ  [R0805]  13.72 19.01 0 top
R11  620Ω  [R0805]  4.95 30.19 0 top
R12  4.7kΩ  [R0805]  10.67 39.2 180 top
R13  4.7kΩ  [R0805]  11.81 32.09 180 top
R14  4.7kΩ  [R0805]  4.19 43.4 180 top
R15  4.7kΩ  [R0805]  20.15 39.75 270 bottom
R16  4.7kΩ  [R0805]  27.15 39.75 270 bottom
R17  4.7kΩ  [R0805]  34.15 39.75 270 bottom
R18  4.7kΩ  [R0805]  41.15 39.75 270 bottom
R19  4.7kΩ  [R0805]  48.15 39.75 270 bottom
R20  4.7kΩ  [R0805]  62.87 41.49 180 bottom
R21  4.7kΩ  [R0805]  58.55 35.14 180 bottom
R22  4.7kΩ  [R0805]  65.28 46.95 180 bottom
R23  300Ω  [R0805]  16 35 270 bottom
R24  300Ω  [R0805]  23 35 270 bottom
R25  300Ω  [R0805]  30 35 270 bottom
R26  300Ω  [R0805]  37 35 270 bottom
R27  300Ω  [R0805]  44 35 270 bottom
R28  300Ω  [R0805]  56.13 38.7 0 bottom
R29  300Ω  [R0805]  51.69 32.47 0 bottom
R30  300Ω  [R0805]  58.67 44.28 180 bottom
R31  4.7kΩ  [R0805]  55.75 7.96 180 top
SW1  KEY_RESET  [SW-SMD_L6.0-W3.5-LS8.1_UK-B0306T-WB-250JZ]  47.62 10.63 0 top
SW2  KEY_UP  [SW-SMD_L6.0-W3.5-LS8.1_UK-B0306T-WB-250JZ]  62 25 0 top
SW3  KEY_DOWN  [SW-SMD_L6.0-W3.5-LS8.1_UK-B0306T-WB-250JZ]  62 18 0 top
SW4  KEY_SET  [SW-SMD_L6.0-W3.5-LS8.1_UK-B0306T-WB-250JZ]  62 11 0 top
SW5  KEY_TEST  [SW-SMD_L6.0-W3.5-LS8.1_UK-B0306T-WB-250JZ]  34.54 7.2 270 top
U1  LM2596S-5.0  [TO-263-5_L10.1-W8.7-P1.70-LS15.2-BR]  15.24 23.33 180 bottom
U2  NSi6801B-DSWFR  [SOIC-6_L7.5-W4.7-P1.27-LS11.50-TL]  64.26 15.96 90 bottom
U3  -  [LQFP-32_L7.0-W7.0-P0.80-LS9.0-BL]  35.18 19.39 0 top

## Footprints (pads in the part's own frame, mm; a bottom-side part is the same pattern mirrored in y, then rotated)
C0805
  rect 1.41x1.35 smd: 1(-1,0) 2(1,0)
CAP-SMD_BD4.0-L4.3-W4.3-LS5.0-FD
  rect 2.8x1.1 smd: 1(-1.661,0) 2(1.661,0)
CAP-SMD_BD8.0-L8.3-W8.3-FD
  rect 4.2x1.4 smd: 1(-3.267,0) 2(3.267,0)
CAP-SMD_BD10.0-L10.3-W10.3-LS11.0-FD
  rect 4.5x1.65 smd: 1(-4.5,0) 2(4.5,0)
DC-IN-TH_DC005
  oval 2x4.6 hole 1.2x3.7: 1(3.1,2.35) 2(-3.1,2.35)
  oval 4.6x2 hole 3.7x1.2: 3(0.1,-2.35)
F1812
  rect 1.407x3.499 smd: 1(-1.853,0) 2(1.853,0)
HDR-TH_2P-P2.54-V-M-3
  rect 1.8x1.8 hole 1.1: 1(-1.27,0)
  round 1.8 hole 1.1: 2(1.27,0)
HDR-TH_3P-P2.50-H-F-W7.0-N
  round 1.4 hole 0.8: 1(-2.5,0) 2(0,0) 3(2.5,0)
HDR-TH_3P-P2.54-V-M
  rect 1.7x1.7 hole 1.1: 1(-2.54,0)
  round 1.7 hole 1.1: 2(0,0) 3(2.54,0)
IND-SMD_L11.0-W10.2_CXP1050
  rect 3.25x4 smd: 1(-4.625,0) 2(4.625,0)
LED-SEG-TH_12P-L37.6-W19.0-P2.54-S15.24-BL
  round 1.4 hole 0.8: 1(-6.35,-7.62) 2(-3.81,-7.62) 3(-1.27,-7.62) 4(1.27,-7.62) 5(3.81,-7.62) 6(6.35,-7.62) 7(6.35,7.62) 8(3.81,7.62) 9(1.27,7.62) 10(-1.27,7.62) 11(-3.81,7.62) 12(-6.35,7.62)
LED-TH_BD3.8-P2.54-RD
  round 1.524 hole 0.9: 1(-1.27,0) 2(1.27,0)
LED-TH_BD3.8-P2.54-RD-RED
  round 1.4 hole 0.7: 1(-1.27,0) 2(1.27,0)
LQFP-32_L7.0-W7.0-P0.80-LS9.0-BL
  oval 0.448x1.684 smd: 1(-2.8,-4.242) 2(-2,-4.242) 3(-1.2,-4.242) 4(-0.4,-4.242) 5(0.4,-4.242) 6(1.2,-4.242) 7(2,-4.242) 8(2.8,-4.242) 17(2.8,4.242) 18(2,4.242) 19(1.2,4.242) 20(0.4,4.242) 21(-0.4,4.242) 22(-1.2,4.242) 23(-2,4.242) 24(-2.8,4.242)
  oval 1.684x0.448 smd: 9(4.242,-2.8) 10(4.242,-2) 11(4.242,-1.2) 12(4.242,-0.4) 13(4.242,0.4) 14(4.242,1.2) 15(4.242,2) 16(4.242,2.8) 25(-4.242,2.8) 26(-4.242,2) 27(-4.242,1.2) 28(-4.242,0.4) 29(-4.242,-0.4) 30(-4.242,-1.2) 31(-4.242,-2) 32(-4.242,-2.8)
R0805
  rect 1.133x1.377 smd: 1(-1,0) 2(1,0)
SMA_L4.3-W2.6-LS5.0-FD
  rect 2.046x1.62 smd: 1(-2.304,-0.009) 2(2.304,0.009)
SOIC-6_L7.5-W4.7-P1.27-LS11.50-TL
  rect 2.16x0.76 smd: 1(-5.2,1.27) 2(-5.2,0) 3(-5.2,-1.27) 4(5.2,-1.27) 5(5.2,0) 6(5.2,1.27)
SOT-23-3_L2.9-W1.6-P1.90-LS2.8-BR
  rect 1.07x0.6 smd: 1(1.235,-0.95) 2(1.235,0.95) 3(-1.235,0)
SOT-23_L2.9-W1.3-P1.90-LS2.4-BR
  rect 1x0.8 smd: 1(1.15,-0.95) 2(1.15,0.95) 3(-1.15,0)
SW-SMD_L6.0-W3.5-LS8.1_UK-B0306T-WB-250JZ
  rect 1.75x1 smd: 1(-3.875,0) 2(3.875,0)
TO-252-3_L6.6-W6.1-P4.57-LS9.9-BR-CW
  rect 2.5x1.2 smd: 1(3.475,-2.286) 3(3.475,2.286)
  rect 6.5x6 smd: 2(-3.475,0)
TO-263-5_L10.1-W8.7-P1.70-LS15.2-BR
  rect 3.358x1.02 smd: 1(5.183,-3.4) 2(5.183,-1.7) 3(5.183,0) 4(5.183,1.7) 5(5.183,3.4)
  rect 9x11 smd: 6(-5.184,0)

## Nets
As in the schematic.

Pads without a net: DC1 3; LED5 6; U2 2; U3 5 16 20 21 22 23 24

## Via types
v1: diameter 0.61, hole 0.305, Top Layer to Bottom Layer, 39 vias

## Routing (per net, layer and track width the routed paths; a pad name or vN(x,y) marks a point on that pad's centre or on a via; arc(x,y) is an arc through that point)
+5V: length 142
  Top Layer w0.254: R10.1 11.05,19.01 9.91,20.16 9.91,21.36 LED2.2 6.27,29.87 R11.2 ; R6.2 63.65,36.5 H3.1 ; v1(60.45,30.57) 61.34,30.57 62.36,29.55 62.36,29.3 62.34,29.28 R7.1 62.47,28.16 R8.1 62.47,16.98 61.71,16.22 R9.1 61.71,11.12 ; v1(41.88,17.78) 41.49,17.39 U3.10 ; v1(41.88,17.78) 41.53,18.12 39.49,18.12 U3.11 ; v1(41.88,17.78) 44.05,17.78 C5.2 44.32,17.5 44.32,16.09 44.83,15.58 ; 12.66,34.25 12.81,34.09 R13.1 12.83,32.08 v1(12.83,30.57) ; R31.1 56.88,8.09 58.67,8.09 61.71,11.12 ; R3.1 64.79,9.34 63.75,10.38 62.45,10.38 61.71,11.12 ; Q2.2 11.62,39.25 R12.1 12.7,39.2 v1(13.33,38.57) ; 44.83,15.58 C6.2 ; 44.83,15.58 43.96,15.58 R5.2 ; Q4.2 5.14,43.45 R14.1 5.14,43.34 v1(5.14,41.92)
  Bottom Layer w0.254: R19.1 R18.1 v1(37.47,40.75) R17.1 R16.1 R15.1 ; R21.1 60.64,35.14 H3.1 63.87,38.36 R20.1 66.28,43.9 R22.1 ; U1.4 6.3,25.03 LED2.2
  Bottom Layer w1.5: L1.2 43.36,16.29 v1(41.88,17.78) 40.13,19.52 C2.1
GND: length 125.5
  Top Layer w0.254: 67.94,17.97 67.94,12.15 66.79,11 SW4.2 ; 67.94,17.97 67.91,18 SW3.2 ; 67.94,17.97 v1(67.94,19.39) 67.94,22.93 SW2.2 ; SW1.2 51.44,10.69 51.44,14.57 50.42,15.58 C6.1 47.75,15.6 47.75,16.98 46.99,17.74 C5.1 46.09,18.7 H2.1 42.86,18.99 U3.12 ; SW5.2 31.94,3.33 v1(31.37,3.9) ; C8.2 46.69,5.04 H1.1 ; v1(40.89,10.63) 40.88,10.65 C7.1
  Bottom Layer w0.254: v1(62.48,44.28) 62.49,44.29 62.49,45.37 ; Q10.2 60.21,38.7 v1(60.2,38.7) ; v1(67.94,19.39) C3.1 ; R2.1 1.79,18.9 1.27,18.38 1.27,8.34 1.64,7.98 R1.1 11.93,7.98 DC1.2 ; Q11.2 55.76,32.23 v1(55.75,32.22) ; v1(60.95,24.85) C4.1 62.5,23.31 62.99,22.82 U2.4 ; Q9.2 v1(49.5,35.05) ; Q8.2 v1(42.5,35.05) ; v1(21.5,35.05) Q5.2 ; v1(35.5,35.05) Q7.2 ; D2.1 47.73,4 H1.1 ; v1(28.5,35.05) Q6.2
  Bottom Layer w1.5: C1.2 21.19,13.37 D1.1 v1(21.19,16.73) 21.19,22.56 U1.6 24.42,23.33 C2.2
DA1: length 19
  Top Layer w0.254: LED5.12 26.27,43.74 Q2.3
DA2: length 28.5
  Top Layer w0.254: Q3.3 14.91,36.72 18.29,40.09 30.24,40.09 LED5.9
DA3: length 35.4
  Top Layer w0.254: Q4.3 37,47.93 LED5.8
DC1: length 1.8
  Bottom Layer w0.254: Q5.3 R23.1
DC2: length 1.8
  Bottom Layer w0.254: Q6.3 R24.1
DC3: length 1.8
  Bottom Layer w0.254: Q7.3 R25.1
DC4: length 1.8
  Bottom Layer w0.254: Q8.3 R26.1
DC5: length 1.8
  Bottom Layer w0.254: Q9.3 R27.1
DC6: length 2.1
  Bottom Layer w0.254: Q10.3 57.13,39.7 R28.2
DC7: length 2
  Bottom Layer w0.254: Q11.3 53.46,33.25 R29.2
DC8: length 2.2
  Bottom Layer w0.254: R30.1 59.67,45.8 Q12.3
FAN+: length 18.8
  Bottom Layer w0.254: H1.2 51.52,2.75 57.04,2.75 R4.2
  Bottom Layer w1.5: Q1.2 52.34,13.74 D2.2 52.34,6.07 51.27,5 H1.2
MCU_DA1: length 48.3
  Top Layer w0.254: U3.2 33.18,13.84 32.69,13.35 29.87,13.35 28.81,12.28 22.95,12.28 17.22,18.02 17.22,19.95 15.54,21.63 14.24,21.63 8.59,27.28 8.59,35.39 9.67,36.47 R12.2 9.72,39.25 Q2.1
MCU_DA2: length 38.5
  Top Layer w0.254: U3.1 32.38,13.95 32.13,13.7 29.64,13.7 28.57,12.64 23.1,12.64 17.58,18.16 17.58,20.09 15.69,21.98 14.39,21.98 10.81,25.57 R13.2 10.81,34.19 10.76,34.25
MCU_DA3: length 55.8
  Top Layer w0.254: U3.3 33.98,13.62 33.35,12.99 30.02,12.99 28.96,11.93 22.81,11.93 16.87,17.87 16.87,19.79 16,20.66 16,20.66 15.39,21.27 14.1,21.27 8.23,27.14 8.23,35.29 3.19,40.33 R14.2 3.24,43.45 Q4.1
MCU_DC1: length 28.4
  Top Layer w0.254: v1(21.5,36.95) 26.36,32.09 26.36,19.46 29.23,16.59 U3.32
  Bottom Layer w0.254: v1(21.5,36.95) Q5.1 R15.2
MCU_DC2: length 26.4
  Top Layer w0.254: v1(28.5,36.95) 26.72,35.17 26.72,19.61 28.93,17.39 U3.31
  Bottom Layer w0.254: v1(28.5,36.95) Q6.1 R16.2
MCU_DC3: length 30
  Top Layer w0.254: v1(35.5,36.95) 31.29,32.74 28.47,32.74 27.08,31.35 27.08,19.75 28.64,18.19 U3.30
  Bottom Layer w0.254: v1(35.5,36.95) Q7.1 R17.2
MCU_DC4: length 35.8
  Top Layer w0.254: U3.29 28.34,18.99 27.43,19.9 27.43,31.2 28.61,32.39 37.94,32.39 v1(42.5,36.95)
  Bottom Layer w0.254: R18.2 Q8.1 v1(42.5,36.95)
MCU_DC5: length 38.2
  Top Layer w0.254: U3.28 30.92,19.77 29.34,19.77 28.09,21.02 28.09,27.28 30.04,29.22 30.1,29.22 30.15,29.27 41.82,29.27 v1(49.5,36.95)
  Bottom Layer w0.254: R19.2 Q9.1 v1(49.5,36.95)
MCU_DC6: length 51.5
  Top Layer w0.254: U3.26 30.91,21.42 29.08,21.42 28.8,21.71 28.8,26.98 30.33,28.51 54.34,28.51 56.95,31.12 56.95,33.86 61.85,38.76 v1(61.85,40.09)
  Bottom Layer w0.254: Q10.1 60.27,41.49 R20.2 61.87,40.11 v1(61.85,40.09)
MCU_DC7: length 42.3
  Top Layer w0.254: U3.25 29.34,22.19 29.16,22.37 29.16,26.83 30.48,28.16 54.48,28.16 57.53,31.2 v1(57.53,33.62)
  Bottom Layer w0.254: v1(57.53,33.62) 57.55,33.63 R21.2 55.83,35.14 Q11.1
MCU_DC8: length 59
  Top Layer w0.254: U3.27 29.41,20.59 28.45,21.56 28.45,27.13 30.19,28.87 39.21,28.87 39.26,28.92 54.1,28.92 56.59,31.41 56.59,34.01 61.26,38.68 61.26,40.34 64.26,43.33 v1(64.26,45.43)
  Bottom Layer w0.254: Q12.1 63.96,47.27 R22.2 64.28,45.44 v1(64.26,45.43)
MCU_FAN_PWM: length 39.4
  Top Layer w0.254: Q14.1 56.07,4.72 ; 56.07,4.72 54.75,6.04 R31.2 ; 56.07,4.72 52.32,0.98 39.75,0.98 37.21,3.52 37.21,15.12 U3.7
MCU_KEY_DOWN: length 35.1
  Top Layer w0.254: v1(37.18,25.23) U3.18 ; R8.2 58.12,18.7 SW3.1 55.88,18 55,18.88 v1(55,25)
  Bottom Layer w0.254: v1(55,25) 52.48,27.52 39.44,27.52 37.4,25.48 37.4,25.45 v1(37.18,25.23)
MCU_KEY_SET: length 40.9
  Top Layer w0.254: R9.2 58.12,12.86 SW4.1 54.99,11 54,11.99 v1(54,25) ; v1(37.98,25.23) U3.17
  Bottom Layer w0.254: v1(37.98,25.23) 39.88,27.14 51.86,27.14 v1(54,25)
MCU_KEY_UP: length 29.9
  Top Layer w0.254: R7.2 58.12,26.07 SW2.1 v1(56,25) ; v1(36.38,25.23) U3.19
  Bottom Layer w0.254: v1(36.38,25.23) 36.59,25.45 36.59,25.48 36.94,25.82 36.96,25.82 39.05,27.9 53.1,27.9 v1(56,25)
MCU_LED: length 45.6
  Top Layer w0.254: LED4.1 7.87,33.4 7.87,26.89 13.84,20.92 15.24,20.92 16.51,19.65 16.51,17.72 22.66,11.57 32.82,11.57 34.78,13.53 U3.4
MCU_RST: length 15.4
  Top Layer w0.254: C8.1 42.03,6.43 43.75,8.15 SW1.1 43.75,11.2 43.18,11.77 R5.1 43.16,12.79 41.78,12.79 41.02,13.55 41.02,15.84 40.26,16.59 U3.9
MCU_RXD: length 6.2
  Top Layer w0.254: 44.32,23 43.99,23 40.79,19.79 U3.13
MCU_SENSOR: length 32.2
  Top Layer w0.254: U3.15 40.35,21.39 42.29,23.33 42.29,25.36 43.69,26.76 56.51,26.76 59.06,29.3 59.06,31.33 61.72,34 H3.2 63.87,34 R6.1
MCU_TEST: length 28.3
  Top Layer w0.254: U3.6 36.38,12.34 35.12,11.08 SW5.1 22.65,11.08 R10.2
MCU_TXD: length 7.6
  Top Layer w0.254: H2.3 42.93,24.14 42.93,23.01 40.51,20.59 U3.14
VSUPPLY: length 103.6
  供电层 w1: v1(66.04,23.33) 66.04,15.46 61.98,11.39 v1(61.98,7.33) 19.62,7.33 DC1.1
  Bottom Layer w0.254: v1(66.04,23.33) 65.53,22.82 U2.6 ; v1(66.04,23.33) 64.52,24.85 C4.2 ; v1(66.04,23.33) 66.44,22.93 C3.2 ; LED1.2 11.95,15
  Bottom Layer w1: U1.1 10.06,16.89 11.95,15 ; DC1.1 15.21,14.6 19.5,10.3 C1.1
  Bottom Layer w1.5: v1(61.98,7.33) F1.2
$1N933: length 41.4
  供电层 w1.5: v1(7.49,21.68) 10.03,19.14 23.88,19.14 v1(30.61,12.41)
  Bottom Layer w1: U1.2 10.01,21.68 v1(7.49,21.68)
  Bottom Layer w1.5: L1.1 34.11,8.91 v1(30.61,12.41) 29.09,13.92 D1.2
$1N1155: length 5
  Bottom Layer w0.254: LED1.1 3.68,14.95 R1.2
$1N1974: length 9.5
  Bottom Layer w0.254: Q1.1 63.25,17.11 64.26,18.12 U2.5
$1N1988: length 6
  Bottom Layer w1.5: F1.1 56.19,10.51 Q1.3
$1N2065: length 4.5
  Bottom Layer w0.254: LED2.1 3.56,24.83 3.56,21.66 R2.2
$1N2770: length 5.5
  Bottom Layer w0.254: R4.1 61.36,2.63 LED3.2
$1N5073: length 8.6
  Top Layer w0.254: Q14.3 60.84,8.09 61.73,8.98 v1(62.99,8.98)
  Bottom Layer w0.254: v1(62.99,8.98) U2.3
$1N5078: length 8.2
  Top Layer w0.254: R3.2 68.45,5.68 v1(68.33,5.55)
  Bottom Layer w0.254: v1(68.33,5.55) 65.53,8.34 U2.1
$2N627: length 3.2
  Top Layer w0.254: U3.8 37.98,13.8 39.13,12.65 C7.2
$3N2148: length 4.9
  Top Layer w0.254: R11.1 3.95,34.78 LED4.2
$4N526: length 13.9
  Bottom Layer w0.254: R23.2 17.91,32.09 27.44,32.09 LED5.1
$4N532: length 9.5
  Bottom Layer w0.254: R24.2 24.27,32.73 29.34,32.73 LED5.2
$4N539: length 5
  Bottom Layer w0.254: R25.2 30.61,34 LED5.3
$4N546: length 3.4
  Bottom Layer w0.254: LED5.4 37,31.61 R26.2
$4N553: length 6.5
  Bottom Layer w0.254: LED5.5 40.66,32.73 42.73,32.73 R27.2
$4N573: length 17.1
  Bottom Layer w0.254: LED5.7 43.19,44.28 R30.2
$4N1142: length 25
  Bottom Layer w0.254: LED5.10 33.73,45.2 35.31,43.62 50.21,43.62 R28.1
$4N1146: length 30.9
  Bottom Layer w0.254: R29.1 50.69,42.36 49.78,43.27 34.04,43.27 LED5.11

## Copper pours and planes (outline as drawn; the poured copper is in the pictures)
+5V on 供电层: 0.55,49.62 69.6,49.62 69.6,0.34 0.55,0.34
GND on Top Layer: 0.25,49.75 69.72,49.75 69.72,0.22 0.25,0.22
GND on Bottom Layer: 0.25,49.62 69.77,49.62 69.77,0.22 0.25,0.22
GND on 地层: 0.38,49.62 69.72,49.62 69.72,0.22 0.38,0.22
VSUPPLY on 供电层: 9.09,10.56 9.4,10.25 14.73,10.25 20.41,4.57 61.31,4.57 68.66,10.91 68.66,24.69 67.87,25.48 63.5,25.48 61.72,23.84 61.72,12.92 59.31,10.5 25.62,10.5 17.83,18.3 10.3,18.3 9.09,17.09

Small or netless copper shapes (teardrops, artwork), in the pictures only: 140 on Top Layer, 156 on Bottom Layer, 1 on 供电层

## Text on the board
Bottom Silkscreen Layer: RxD | TxD | GND
